# Altium schematic sheet Comnunication.SchDoc
size A3; SheetNumber: 1; SheetTotal: 13
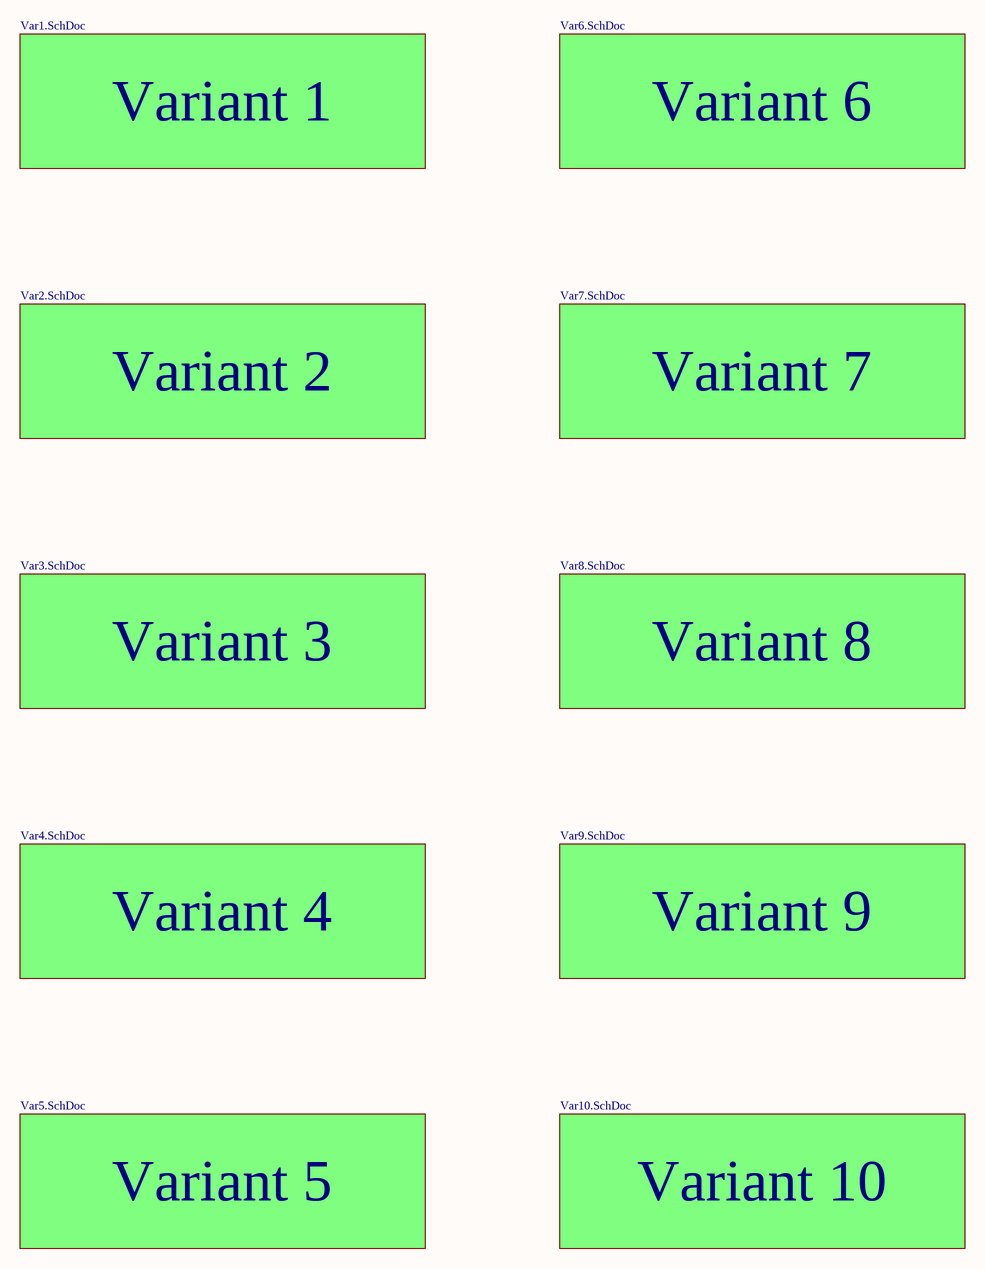
[diagram p0: Comnunication.SchDoc]

## Sub-sheets
Variant 1 = Var1.SchDoc: no entries
Variant 2 = Var2.SchDoc: no entries
Variant 3 = Var3.SchDoc: no entries
Variant 4 = Var4.SchDoc: no entries
Variant 5 = Var5.SchDoc: no entries
Variant 6 = Var6.SchDoc: no entries
Variant 7 = Var7.SchDoc: no entries
Variant 8 = Var8.SchDoc: no entries
Variant 9 = Var9.SchDoc: no entries
Variant 10 = Var10.SchDoc: no entries